# Altium schematic sheet USB_mega.SchDoc
size B
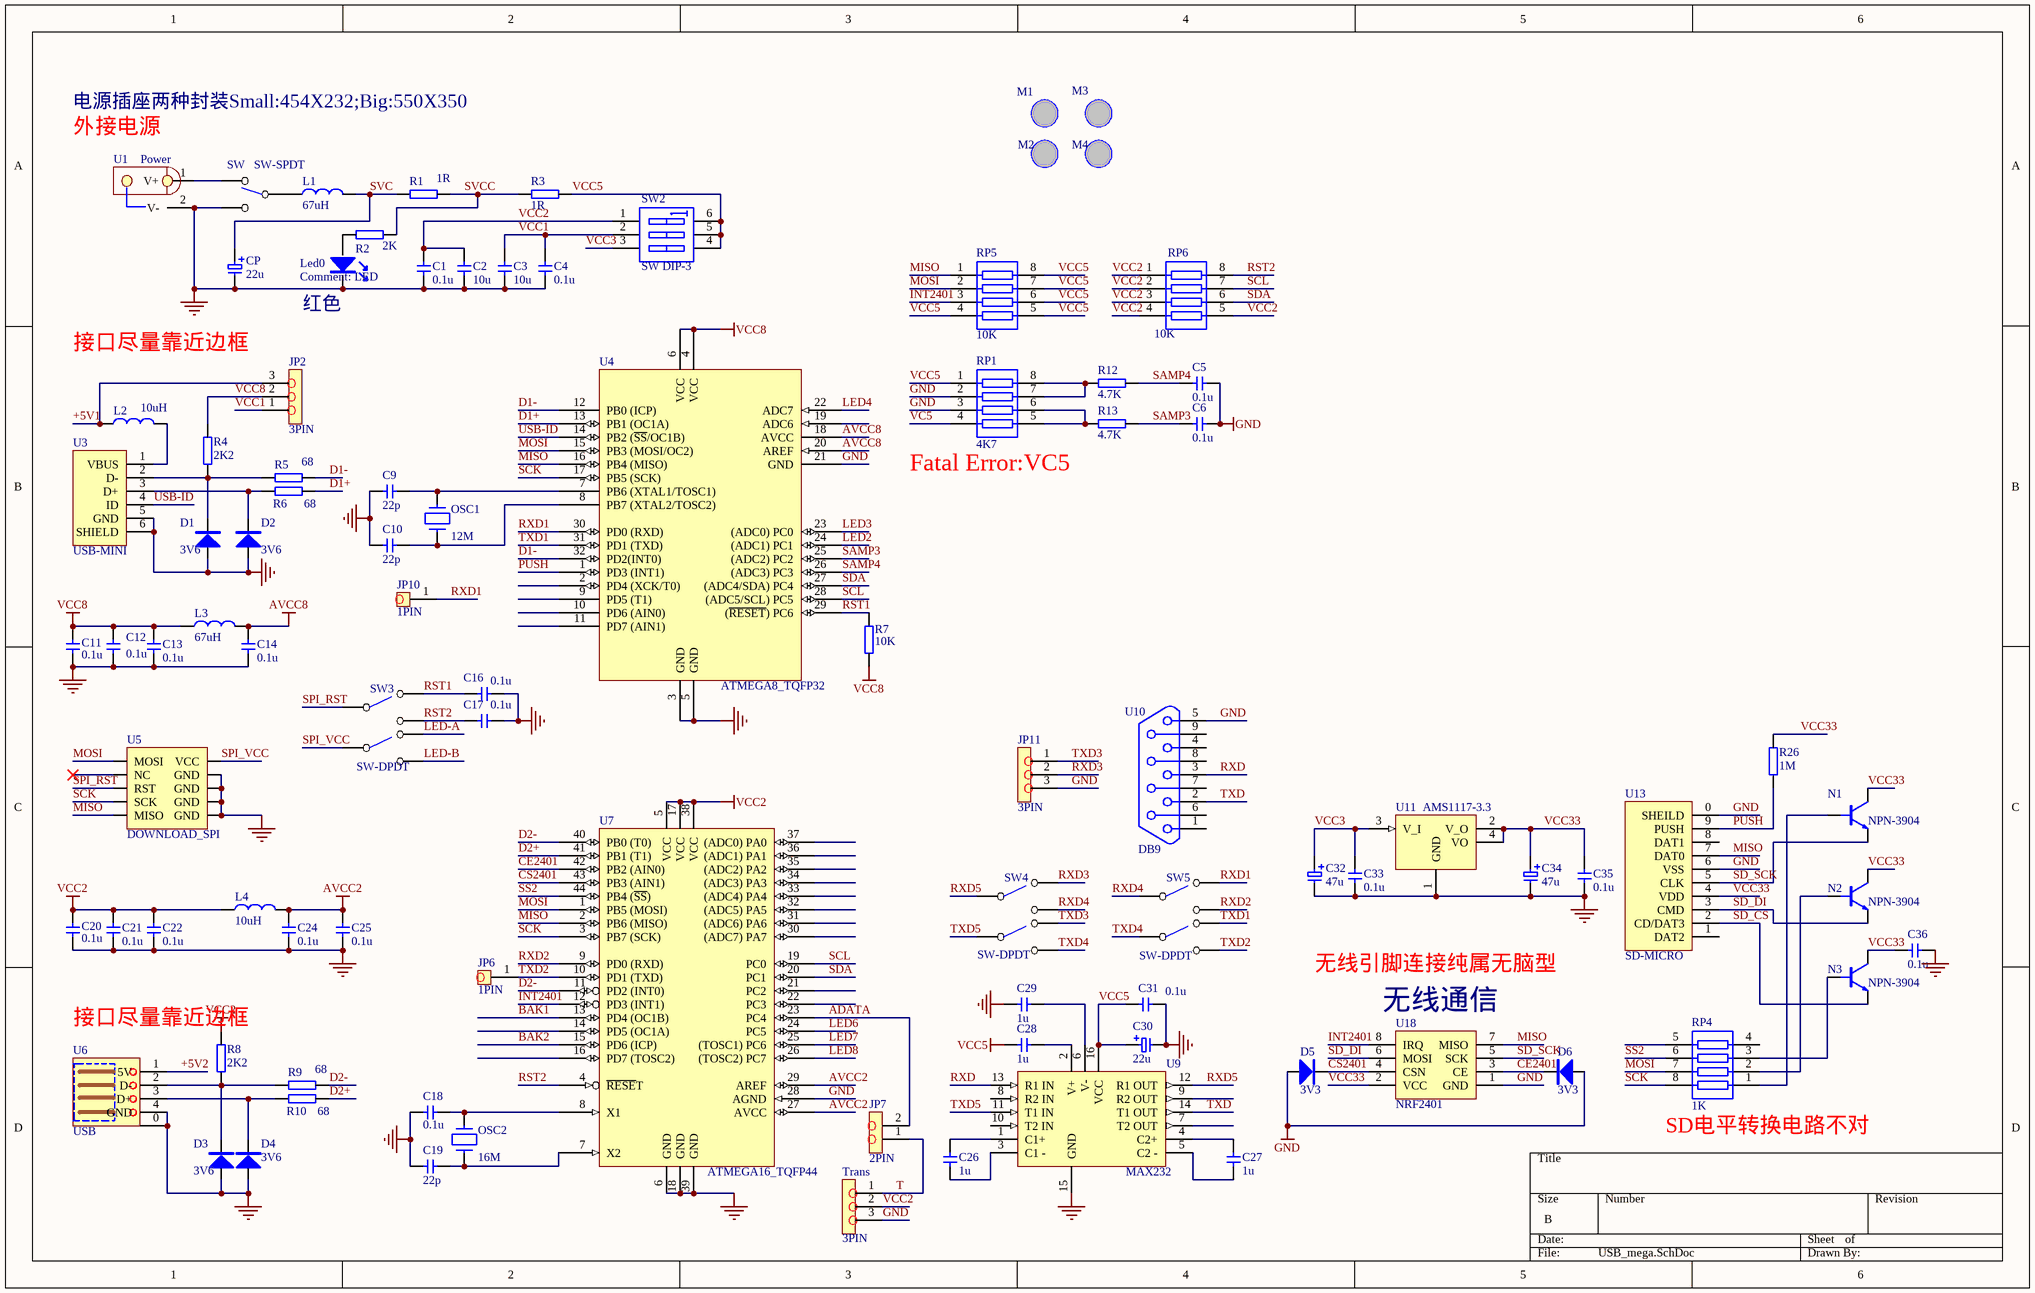
[diagram p0: USB_mega.SchDoc]

## Parts
C1  0.1u  [0805]
C2  10u  [0805]
C3  10u  [0805]
C4  0.1u  [0805]
C5  0.1u  [RC100]
C6  0.1u  [RC100]
C9  22p  [RC80]
C10  22p  [RC80]
C11  0.1u  [0805]
C12  0.1u  [0805]
C13  0.1u  [0805]
C14  0.1u  [0805]
C16  0.1u  [0805]
C17  0.1u  [0805]
C18  0.1u  [RC80]
C19  22p  [RC80]
C20  0.1u  [0805]
C21  0.1u  [0805]
C22  0.1u  [0805]
C24  0.1u  [0805]
C25  0.1u  [0805]
C26  1u  [0805]
C27  1u  [0805]
C28  1u  [0805]
C29  1u  [0805]
C30  22u  [CP+140]
C31  0.1u  [0805]
C32  47u  [CP+140]
C33  0.1u  [0805]
C34  47u  [CP+140]
C35  0.1u  [0805]
C36  0.1u  [0805]
CP  22u  [CP+140]
D1  3V6  [DC140]
D2  3V6  [DC140]
D3  3V6  [DC140]
D4  3V6  [DC140]
D5  3V3  [DC200]
D6  3V3  [DC200]
JP2  3PIN  [SIP3]
JP6  1PIN  [SIP1]
JP7  2PIN  [SIP2]
JP10  1PIN  [SIP1]
JP11  3PIN  [SIP3]
L1  67uH  [1206]
L2  10uH  [0805]
L3  67uH  [1206]
L4  10uH  [0805]
Led0  LED  [LED100]
M1  M3  [M3]  (value not drawn)
M2  M3  [M3]  (value not drawn)
M3  M3  [M3]  (value not drawn)
M4  M3  [M3]  (value not drawn)
N1  NPN-3904  [SOT-23A]
N2  NPN-3904  [SOT-23A]
N3  NPN-3904  [SOT-23A]
OSC1  12M  [OSC200]
OSC2  16M  [OSC200]
R1  1R  [0805]
R2  2K  [0805]
R3  1R  [0805]
R4  2K2  [0805]
R5  68  [0805]
R6  68  [0805]
R7  10K  [0805]
R8  2K2  [0805]
R9  68  [0805]
R10  68  [0805]
R12  4.7K  [0805]
R13  4.7K  [0805]
R26  1M  [0805]
RP1  4K7  [RN4]
RP4  1K  [RN4]
RP5  10K  [RN4]
RP6  10K  [RN4]
SW  SW-SPDT  [SW-SPDT]
SW2  SW DIP-3  [SW-DIP3]
SW3  SW-DPDT  [SW-DPDT]
SW4  SW-DPDT  [SW-DPDT]
SW5  SW-DPDT  [SW-DPDT]
Trans  3PIN  [SIP3]
U1  Power  [POWER_BIG]
U3  USB-MINI  [USB-MINI-R]
U4  ATMEGA8_TQFP32  [TQFP-32]
U5  DOWNLOAD_SPI  [DOWNLOAD]
U6  USB  [USB-A-R]
U7  ATMEGA16_TQFP44  [TQFP-44]
U9  MAX232  [SO-16]
U10  DB9  [DB-9RA/F]
U11  AMS1117-3.3  [SOT-223]
U13  SD-MICRO  [TF-2]
U18  NRF2401  [NRF2401]

## Nets
AVCC2: C24.1 C25.1 L4.2 U7.27(AVCC) U7.29(AREF)
AVCC8: C14.1 L3.2 U4.18(AVCC) U4.20(AREF)
GND: C1.1 C2.1 C3.1 C4.1 C5.2 C6.2 C9.1 C10.1 C11.2 C12.2 C13.2 C14.2 C16.1 C17.1 C18.1 C19.1 C20.1 C21.1 C22.2 C24.2 C25.2 C29.1 C30.2 C31.2 C32.2 C33.2 C34.2 C35.2 C36.2 CP.2 D1.A D2.A D3.A D4.A D5.A D6.A JP11.3 Led0.K RP1.2 RP1.3 SW.1 Trans.3 U1.2(V-) U3.5(GND) U3.6(SHIELD) U4.3(GND) U4.5(GND) U4.21(GND) U5.4(GND) U5.6(GND) U5.8(GND) U5.10(GND) U6.0 U6.4(GND) U7.6(GND) U7.18(GND) U7.28(AGND) U7.39(GND) U9.15(GND) U10.5 U11.1(GND) U13.0(SHEILD) U13.6(VSS) U18.1(GND)
VCC2: C1.2 C2.2 C20.2 C21.2 C22.1 L4.1 R8.2 RP6.1 RP6.2 RP6.3 RP6.4 RP6.5 SW2.1(A1) Trans.2 U7.5(VCC) U7.17(VCC) U7.38(VCC)
VCC5: C28.1 C30.1 C31.1 R3.2 RP1.1 RP5.4 RP5.5 RP5.6 RP5.7 RP5.8 SW2.4(B3) SW2.5(B2) SW2.6(B1) U9.16(VCC)
VCC8: C11.1 C12.1 C13.1 JP2.2 L3.1 R4.2 R7.2 U4.4(VCC) U4.6(VCC)
+5V1: JP2.3 L2.1
+5V2: U6.1(5V)
ADATA: JP7.2 U7.23(PC4)
BAK1: U7.13(PD4_(OC1B))
BAK2: U7.15(PD6_(ICP))
CE2401: D6.K U7.42(PB2_(AIN0)) U18.3(CE)
CS2401: D5.K U7.43(PB3_(AIN1)) U18.4(CSN)
D1+: R6.2 U4.13(PB1_(OC1A))
D1-: R5.2 U4.12(PB0_(ICP)) U4.32(PD2(INT0))
D2+: R10.2 U7.41(PB1_(T1))
D2-: R9.2 U7.11(PD2_(INT0)) U7.40(PB0_(T0))
INT2401: RP5.3 U7.12(PD3_(INT1)) U18.8(IRQ)
LED2: U4.24((ADC1)_PC1)
LED3: U4.23((ADC0)_PC0)
LED4: U4.22(ADC7)
LED6: U7.24(PC5)
LED7: U7.25((TOSC1)_PC6)
LED8: U7.26((TOSC2)_PC7)
LED-A: SW3.5
LED-B: SW3.6
MISO: RP5.1 U4.16(PB4_(MISO)) U5.9(MISO) U7.2(PB6_(MISO)) U13.7(DAT0) U18.7(MISO)
MOSI: RP4.7 RP5.2 U4.15(PB3_(MOSI/OC2)) U5.1(MOSI) U7.1(PB5_(MOSI))
PUSH: R26.1 U4.1(PD3_(INT1)) U13.9(PUSH)
RST1: C16.2 R7.1 SW3.2 U4.29((~{RESET})_PC6)
RST2: C17.2 RP6.8 SW3.3 U7.4(~{RESE}T)
RXD: U9.13(R1_IN) U10.3
RXD1: JP10.1 SW5.2 U4.30(PD0_(RXD))
RXD2: SW5.3 U7.9(PD0_(RXD))
RXD3: JP11.2 SW4.2
RXD4: SW4.3 SW5.1
RXD5: SW4.1 U9.12(R1_OUT)
SAMP3: C6.1 R13.2 U4.25((ADC2)_PC2)
SAMP4: C5.1 R12.2 U4.26((ADC3)_PC3)
SCK: RP4.8 U4.17(PB5_(SCK)) U5.7(SCK) U7.3(PB7_(SCK))
SCL: RP6.7 U4.28((ADC5/SCL)_PC5) U7.19(PC0)
SD_CS: N3.E U13.2(CD/DAT3)
SD_DI: N2.E U13.3(CMD) U18.6(MOSI)
SD_SCK: N1.E U13.5(CLK) U18.5(SCK)
SDA: RP6.6 U4.27((ADC4/SDA)_PC4) U7.20(PC1)
SPI_RST: SW3.1 U5.5(RST)
SPI_VCC: SW3.4 U5.2(VCC)
SS2: RP4.6 U7.44(PB4_(~{SS}))
SVC: CP.1 L1.2 R1.1
SVCC: R1.2 R2.1 R3.1
T: JP7.1 Trans.1
TXD: U9.14(T1_OUT) U10.2
TXD1: SW5.5 U4.31(PD1_(TXD))
TXD2: JP6.1 SW5.6 U7.10(PD1_(TXD))
TXD3: JP11.1 SW4.5
TXD4: SW4.6 SW5.4
TXD5: SW4.4 U9.11(T1_IN)
USB-ID: U3.4(ID) U4.14(PB2_(~{SS}/OC1B))
VC5: RP1.4
VCC1: C3.2 C4.2 JP2.1 SW2.2(A2)
VCC3: C32.1 C33.1 SW2.3(A3) U11.3(V_I)
VCC33: C34.1 C35.1 C36.1 N1.C N2.C N3.C R26.2 U11.2(V_O) U11.4(VO) U13.4(VDD) U18.2(VCC)
NetC9_2: C9.2 OSC1.2 U4.7(PB6_(XTAL1/TOSC1))
NetC10_2: C10.2 OSC1.1 U4.8(PB7_(XTAL2/TOSC2))
NetC18_2: C18.2 OSC2.2 U7.8(X1)
NetC19_2: C19.2 OSC2.1 U7.7(X2)
NetC26_1: C26.1 U9.1(C1+)
NetC26_2: C26.2 U9.3(C1_-)
NetC27_1: C27.1 U9.4(C2+)
NetC27_2: C27.2 U9.5(C2_-)
NetC28_2: C28.2 U9.2(V+)
NetC29_2: C29.2 U9.6(V-)
NetD1_K: D1.K R4.1 R5.1 U3.2(D-)
NetD2_K: D2.K R6.1 U3.3(D+)
NetD3_K: D3.K R8.1 R9.1 U6.2(D-)
NetD4_K: D4.K R10.1 U6.3(D+)
NetL1_1: L1.1 SW.2
NetL2_2: L2.2 U3.1(VBUS)
NetLed0_A: Led0.A R2.2
NetN1_B: N1.B RP4.1
NetN2_B: N2.B RP4.2
NetN3_B: N3.B RP4.3
NetR12_1: R12.1 RP1.7 RP1.8
NetR13_1: R13.1 RP1.5 RP1.6
NetSW_3: SW.3 U1.1(V+)

Not connected (* = marked no-connect by the designer): RP4 4 5; U4 2(PD4_(XCK/T0)) 9(PD5_(T1)) 10(PD6_(AIN0)) 11(PD7_(AIN1)) 19(ADC6); U5 3(NC)*; U7 14(PD5_(OC1A)) 16(PD7_(TOSC2)) 21(PC2) 22(PC3) 30((ADC7)_PA7) 31((ADC6)_PA6) 32((ADC5)_PA5) 33((ADC4)_PA4) 34((ADC3)_PA3) 35((ADC2)_PA2) 36((ADC1)_PA1) 37((ADC0)_PA0); U9 7(T2_OUT) 8(R2_IN) 9(R2_OUT) 10(T2_IN); U10 1 4 6 7 8 9; U13 1(DAT2) 8(DAT1)

## Notes on the sheet
- 外接电源
- 电源插座两种封装Small:454X232;Big:550X350
- 接口尽量靠近边框
- (near Led0) 红色
- Fatal Error:VC5
- 无线引脚连接纯属无脑型
- (near U18) 无线通信
- (near RP4) SD电平转换电路不对

## Library data of the parts
C1-C6 C9-C14 C16-C22 C24-C29 C31 C33 C35 C36 = CAPA
C30 C32 C34 CP = CAP+
D1-D6 = DIODE
L1-L4 = LH
N1-N3 = NPN-A
OSC1 OSC2 = CRYSTAL
R1-R10 R12 R13 R26 = RES2A
RP1 RP4-RP6 = RESPACK4
SW2 = SW DIP-3: DIP Switch
U4 = ATMEGA8_TQFP32: Atmel Microcontroller - Library created by carel..  <www.mpfreezone.com>
U7 = AT90S8535_TQFP44: Atmel Microcontroller - Library created by carel..  <www.mpfreezone.com>
U11 = VOTAGE_V33